# EAGLE design RecoveryBoard (EAGLE 9.4.2)

## Sheet 1 of 2: Power
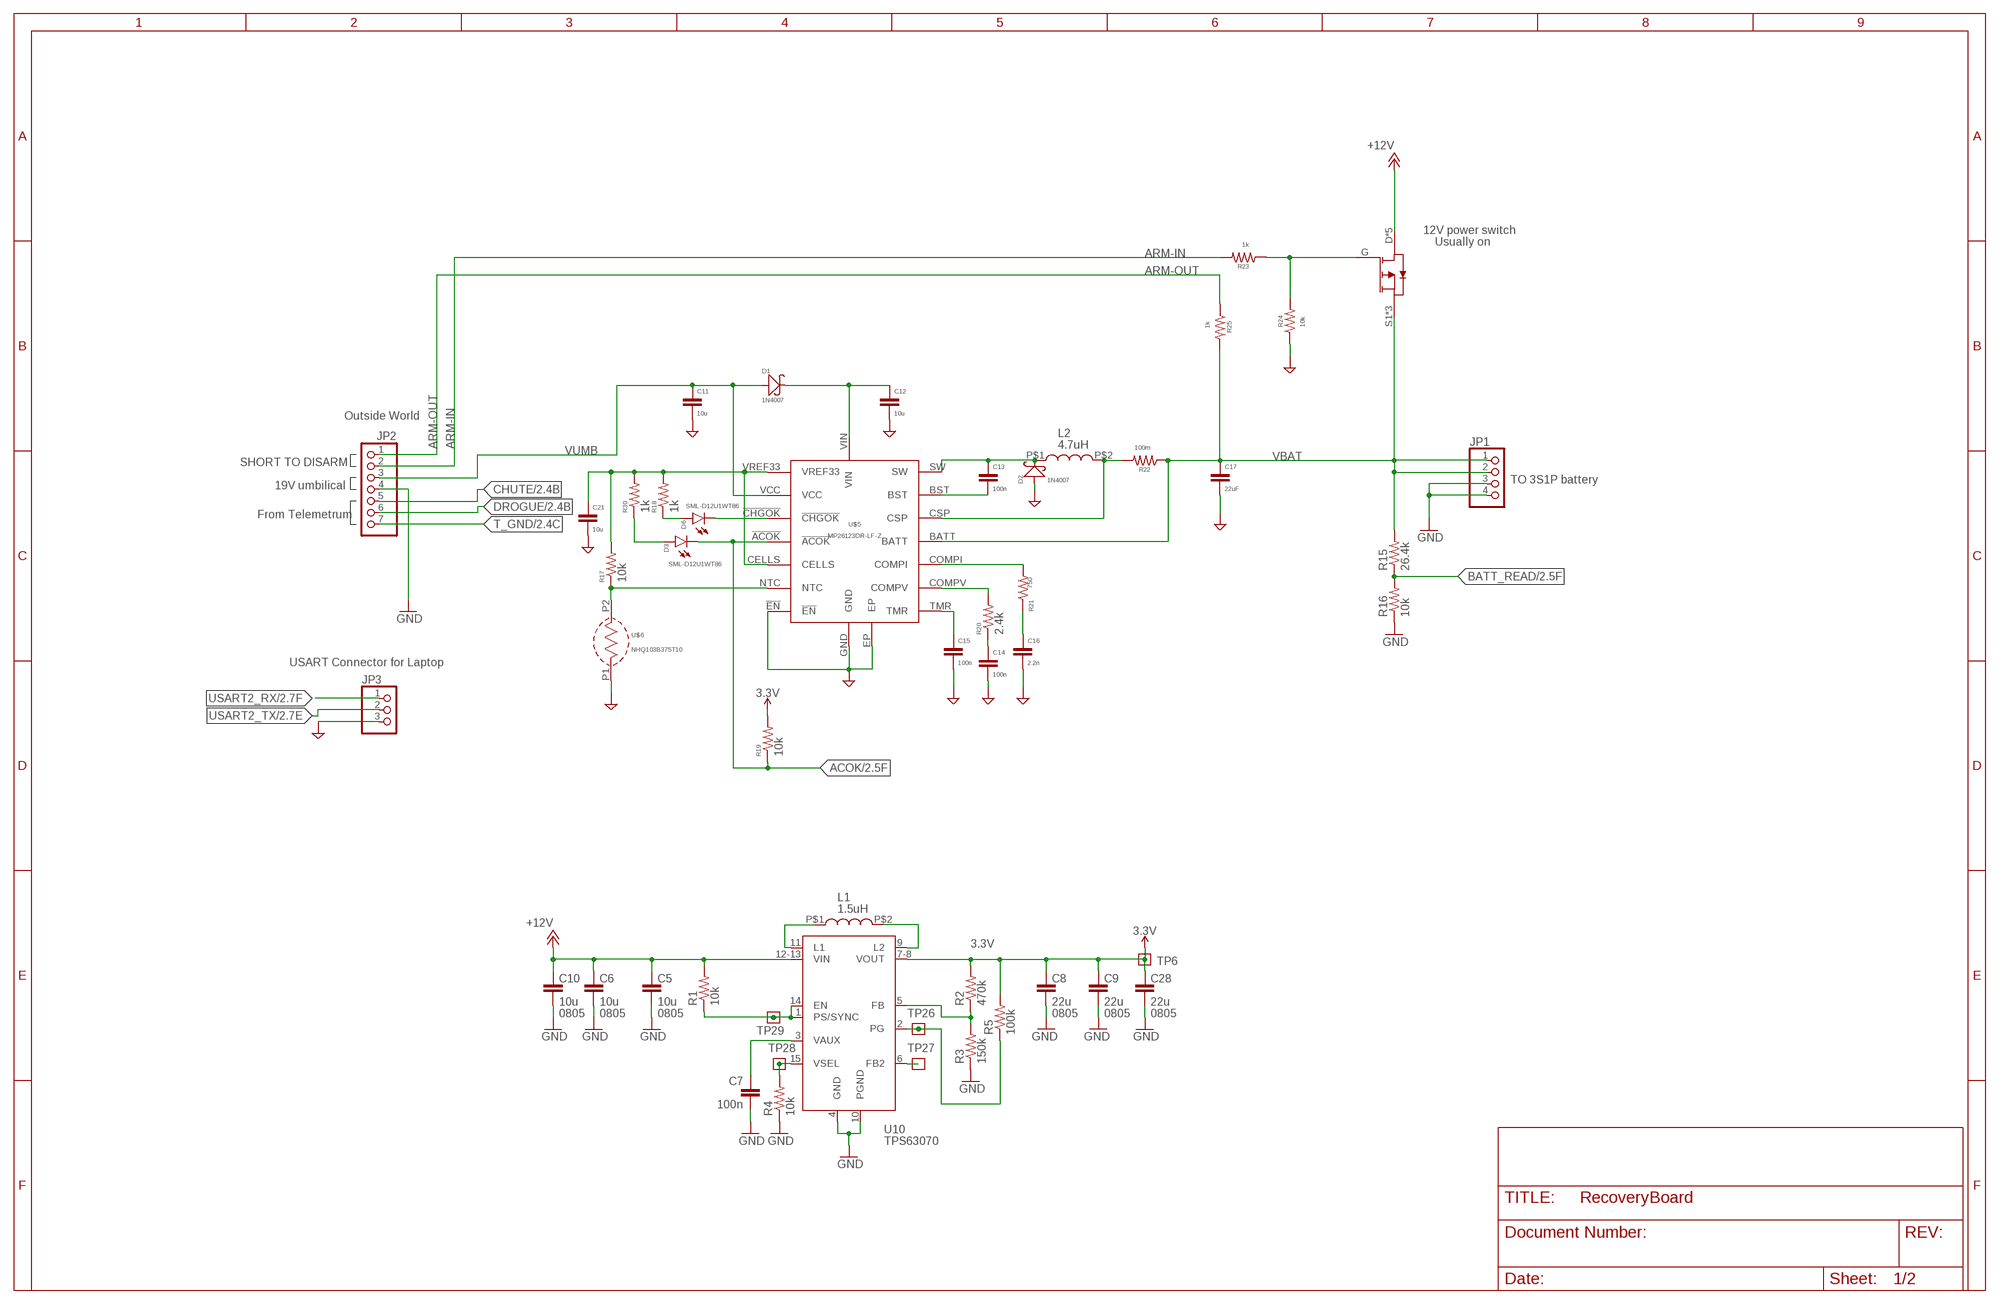
[diagram p0: schematic, sheet 1]

### Parts
C5  10u  C-EU0805-C-NOSILK  [.0805-C-NOSILK]
C6  10u  C-EU0805-C-NOSILK  [.0805-C-NOSILK]
C7  100n  C-EU0603-C-NOSILK  [.0603-C-NOSILK]
C8  22u  C-EU0805-C-NOSILK  [.0805-C-NOSILK]
C9  22u  C-EU0805-C-NOSILK  [.0805-C-NOSILK]
C10  10u  C-EU0805-C-NOSILK  [.0805-C-NOSILK]
C11  10u  C-EU0805-C-NOSILK  [.0805-C-NOSILK]
C12  10u  C-EU0805-C-NOSILK  [.0805-C-NOSILK]
C13  100n  C-EU0603-C-NOSILK  [.0603-C-NOSILK]
C14  100n  C-EU0603-C-NOSILK  [.0603-C-NOSILK]
C15  100n  C-EU0603-C-NOSILK  [.0603-C-NOSILK]
C16  2.2n  C-EU0603-C-NOSILK  [.0603-C-NOSILK]
C17  22uF  C-EU0805-C-NOSILK  [.0805-C-NOSILK]
C21  10u  C-EU0805-C-NOSILK  [.0805-C-NOSILK]
C28  22u  C-EU0805-C-NOSILK  [.0805-C-NOSILK]
D1  1N4007  DIODE-SCHOTTKY-(DO-214AC)  [DO-214AC]
D2  1N4007  DIODE-SCHOTTKY-(DO-214AC)  [DO-214AC]
D3  SML-D12U1WT86  LEDCHIPLED_0603  [CHIPLED_0603]
D6  SML-D12U1WT86  LEDCHIPLED_0603  [CHIPLED_0603]
JP1  PINHD-1X4  [1X04]
JP2  PINHD-1X7  [1X07]
JP3  PINHD-1X3  [1X03]
L1  1.5uH  IHLP2020CZER1R5M11  [IHLP2020CZER1R5M11]
L2  4.7uH  IHLP2020BZER4R7M11  [IHLP2020BZER4R7M11]
R1  10k  R-US_0603-C-NOSILK  [.0603-C-NOSILK]
R2  470k  R-US_0805-A-NOSILK  [.0805-A-NOSILK]
R3  150k  R-US_0603-C-NOSILK  [.0603-C-NOSILK]
R4  10k  R-US_0603-C-NOSILK  [.0603-C-NOSILK]
R5  100k  R-US_0805-A-NOSILK  [.0805-A-NOSILK]
R15  26.4k  R-US_0603-C-NOSILK  [.0603-C-NOSILK]
R16  10k  R-US_0603-C-NOSILK  [.0603-C-NOSILK]
R17  10k  R-US_0603-C-NOSILK  [.0603-C-NOSILK]
R18  1k  R-US_0603-C-NOSILK  [.0603-C-NOSILK]
R19  10k  R-US_0603-C-NOSILK  [.0603-C-NOSILK]
R20  2.4k  R-US_0603-C-NOSILK  [.0603-C-NOSILK]
R21  750  R-US_0603-C-NOSILK  [.0603-C-NOSILK]
R22  100m  R-US_1206-C  [1206-C]
R23  1k  R-US_0603-C-NOSILK  [.0603-C-NOSILK]
R24  10k  R-US_0603-C-NOSILK  [.0603-C-NOSILK]
R25  1k  R-US_0603-C-NOSILK  [.0603-C-NOSILK]
R30  1k  R-US_0603-C-NOSILK  [.0603-C-NOSILK]
TP6  TEST-POINT  [2MM-TEST-POINT]
TP26  TEST-POINT  [2MM-TEST-POINT]
TP27  TEST-POINT  [2MM-TEST-POINT]
TP28  TEST-POINT  [2MM-TEST-POINT]
TP29  TEST-POINT  [2MM-TEST-POINT]
U10  TPS63070  TPS63070X  [TPS63070X]
U$5  MP26123DR-LF-Z  [MP26123DR-LF-Z]
U$6  NHQ103B375T10  [NHQ103B375T10]
U$8  SI7465DP  [SI7465DP]

### Nets
3.3V: C8.1 C9.1 C28.1 R2.2 R5.2 R19.2 TP6.1 U10.7-8(VOUT) ; also sheet 2
!BEN: C12.1 D1.2(-) U$5.VIN
+12V: C5.1 C6.1 C10.1 R1.2 U10.12-13(VIN) U$8.D U$8.D1(D) U$8.D2(D) U$8.D3(D) U$8.D4(D) ; also sheet 2
ACOK: D3.C R19.1 U$5.!ACOK ; also sheet 2
ARM-IN: JP2.2 R23.2
ARM-OUT: JP2.1 R25.1
BATT_READ: R15.1 R16.2 ; also sheet 2
CHUTE: JP2.5 ; also sheet 2
DROGUE: JP2.6 ; also sheet 2
GND: C5.2 C6.2 C7.2 C8.2 C9.2 C10.2 C11.2 C12.2 C14.2 C15.2 C16.2 C17.2 C21.2 C28.2 D2.1(+) JP1.3 JP1.4 JP2.4 JP3.3 R3.1 R4.1 R16.1 R24.1 U10.4(GND) U10.10(PGND) U$5.!EN U$5.EP U$5.GND U$6.P1 ; also sheet 2
N$10: C13.1 D2.2(-) L2.P$1 U$5.SW
N$11: C13.2 U$5.BST
N$12: C21.1 R17.2 R18.2 R30.2 U$5.CELLS U$5.VREF33
N$13: D6.C U$5.!CHGOK
N$14: D3.A R30.1
N$16: R23.1 R24.2 U$8.G
N$17: D6.A R18.1
N$18: R20.2 U$5.COMPV
N$19: C15.1 U$5.TMR
N$20: R17.1 U$5.NTC U$6.P2
N$21: R21.2 U$5.COMPI
N$22: C16.1 R21.1
N$28: L2.P$2 R22.2 U$5.CSP
N$30: C14.1 R20.1
T_GND: JP2.7 ; also sheet 2
TPS-EN: R1.1 TP29.1 U10.1(PS/SYNC) U10.14(EN)
TPS-FB: R2.1 R3.2 U10.5(FB)
TPS-FB2: TP27.1 U10.6(FB2)
TPS-L1: L1.P$1 U10.11(L1)
TPS-L2: L1.P$2 U10.9(L2)
TPS-PG: R5.1 TP26.1 U10.2(PG)
TPS-VAUX: C7.1 U10.3(VAUX)
TPS-VSEL: R4.2 TP28.1 U10.15(VSEL)
USART2_RX: JP3.1 ; also sheet 2
USART2_TX: JP3.2 ; also sheet 2
VBAT: C17.1 JP1.1 JP1.2 R15.2 R22.1 R25.2 U$5.BATT U$8.S1(S) U$8.S2(S) U$8.S3(S)
VUMB: C11.1 D1.1(+) JP2.3 U$5.VCC

### Notes on the sheet
- 12V power switch
- Usually on
- Outside World
- SHORT TO DISARM
- TO 3S1P battery
- 19V umbilical
- From Telemetrum
- USART Connector for Laptop
- 0805 | 0805 | 0805 | 0805 | 0805 | 0805

## Sheet 2 of 2: Microcontroller
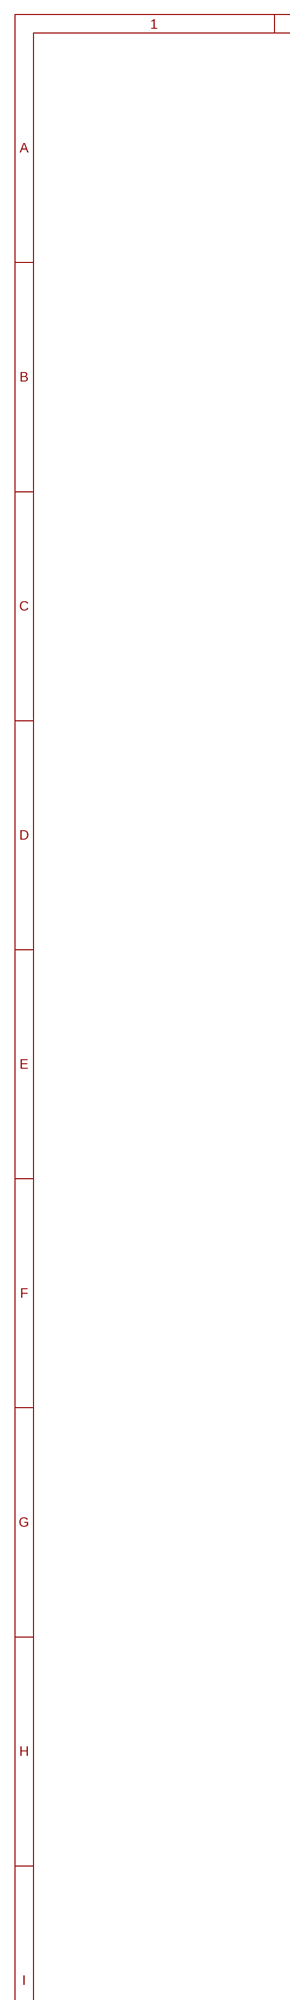
[diagram p1: schematic, sheet 2, part 1 of 2]
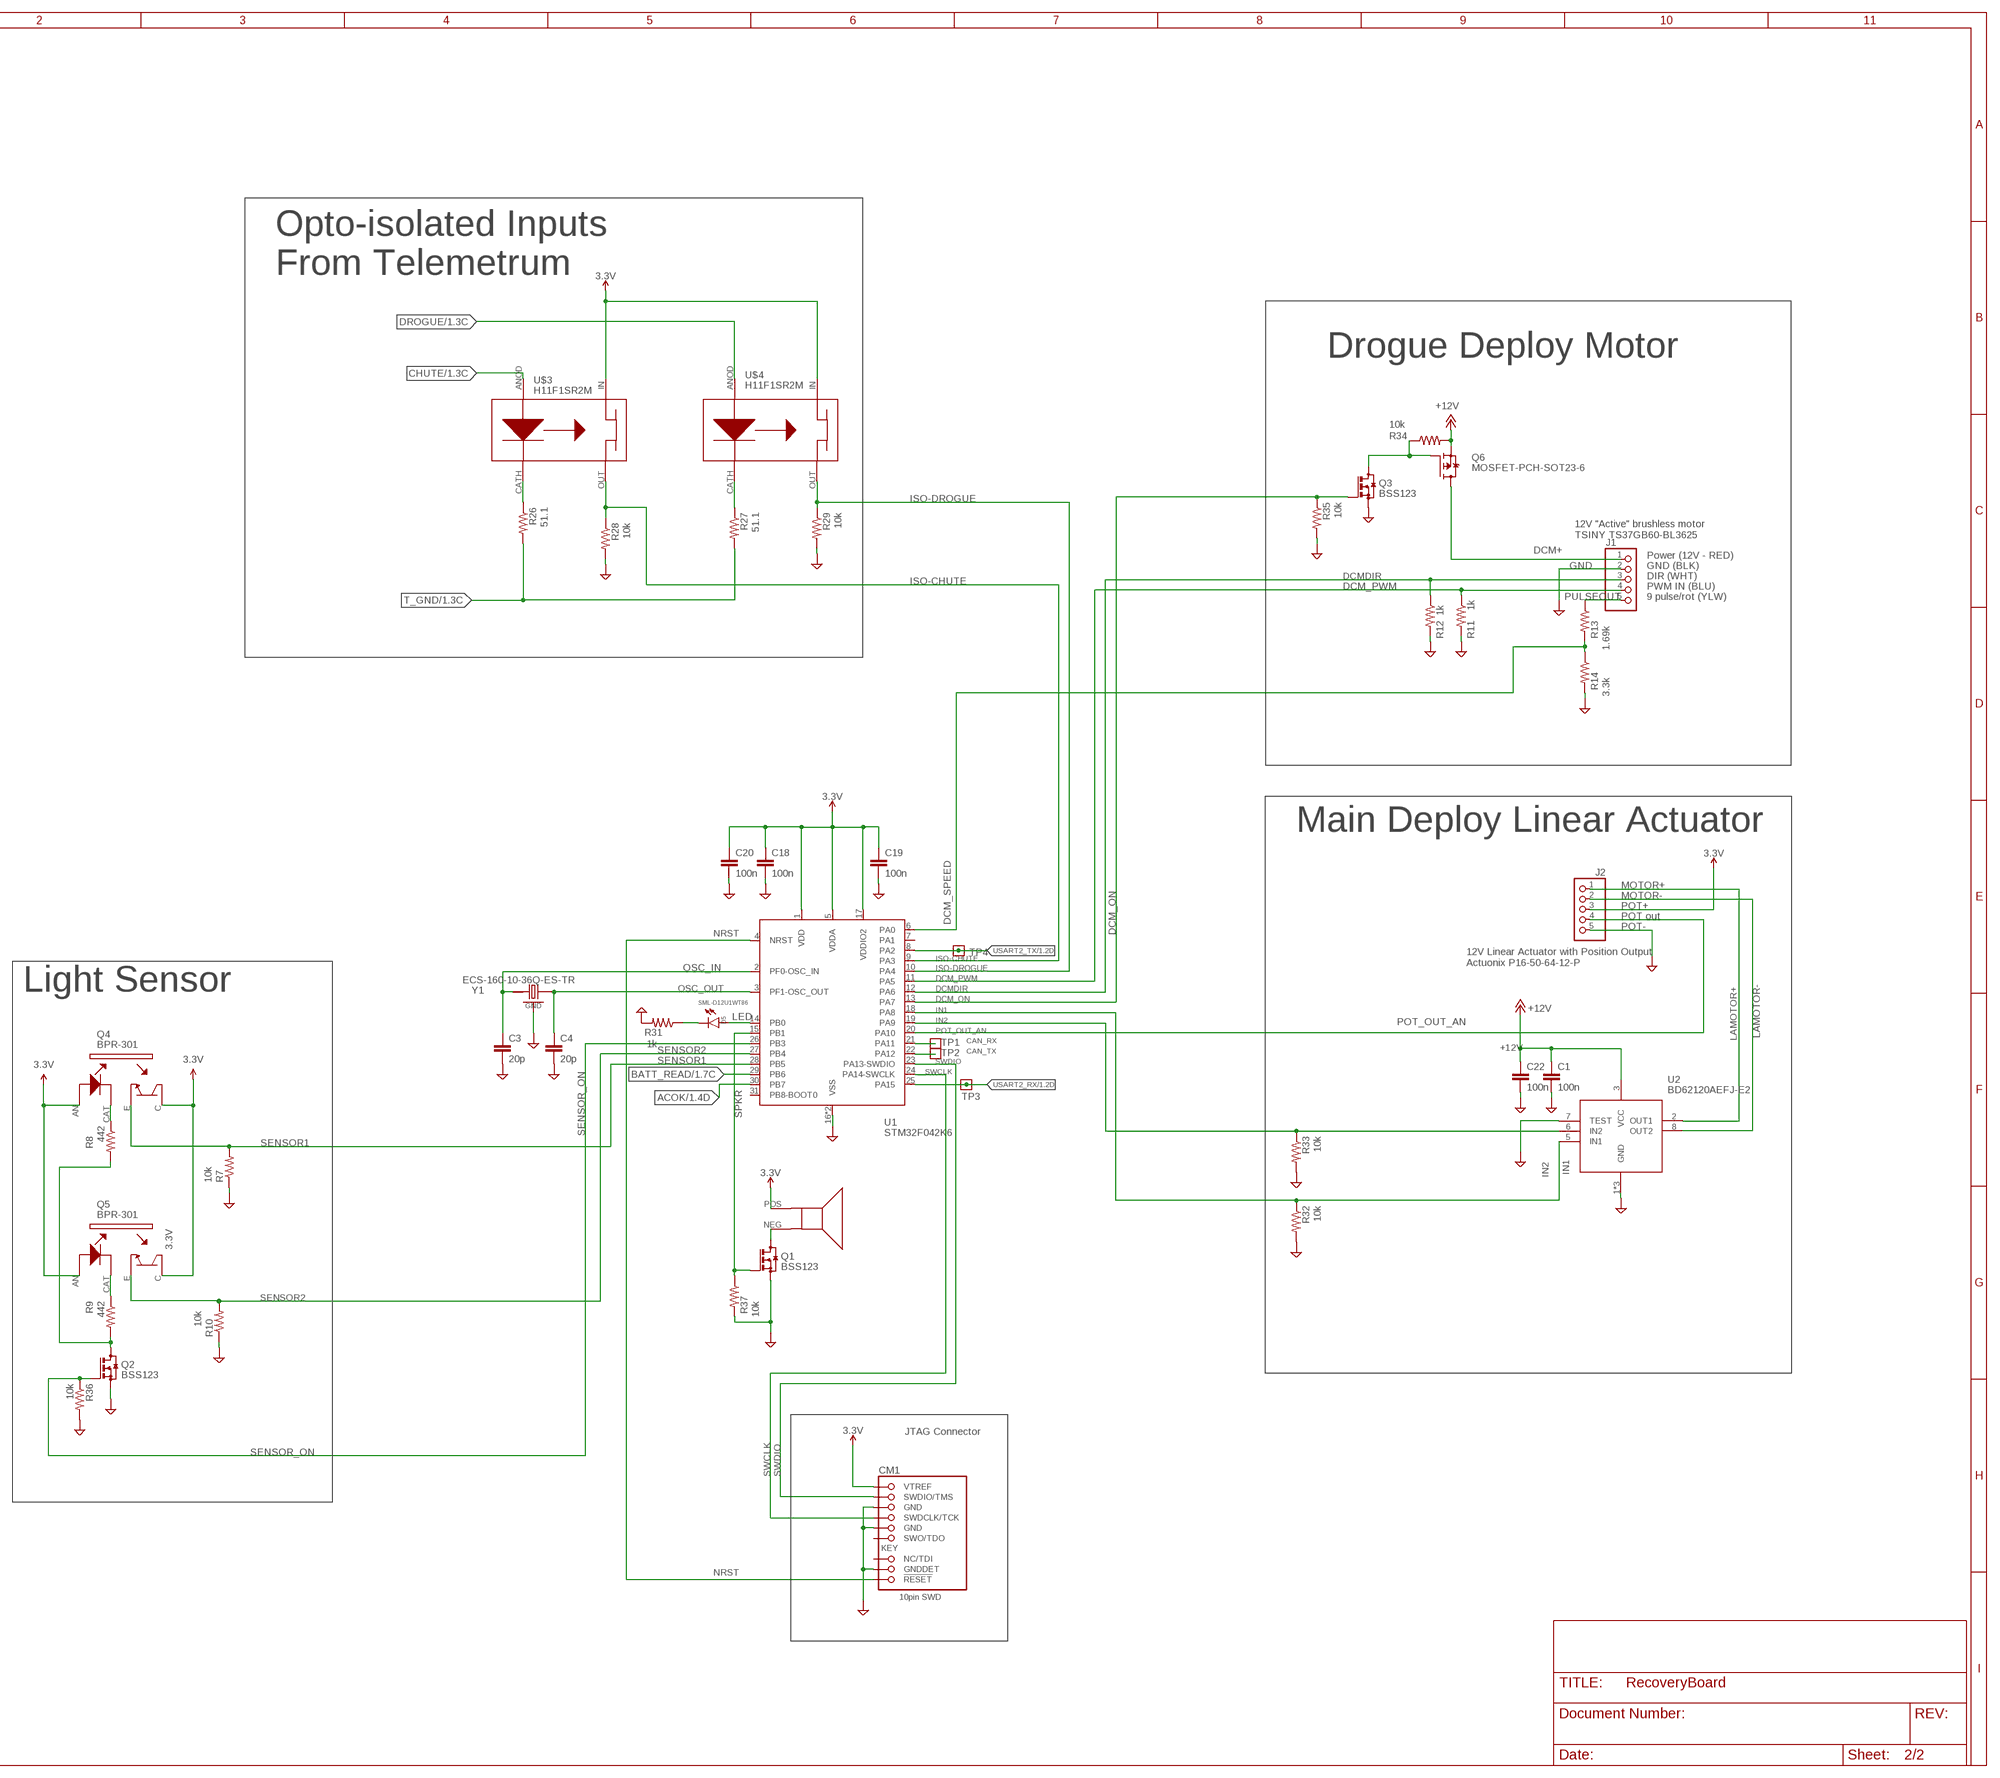
[diagram p2: schematic, sheet 2, part 2 of 2]

### Parts
C1  100n  C-EU0603-C-NOSILK  [.0603-C-NOSILK]
C3  20p  C-EU0603-C-NOSILK  [.0603-C-NOSILK]
C4  20p  C-EU0603-C-NOSILK  [.0603-C-NOSILK]
C18  100n  C-EU0603-C-NOSILK  [.0603-C-NOSILK]
C19  100n  C-EU0603-C-NOSILK  [.0603-C-NOSILK]
C20  100n  C-EU0603-C-NOSILK  [.0603-C-NOSILK]
C22  100n  C-EUC1206  [C1206]
CM1  FTSH-105-XX-X-DV-K  [CON10_2X5_DUK_FTSH]
D5  SML-D12U1WT86  LEDCHIPLED_0603  [CHIPLED_0603]
J1  PINHD-1X5  [1X05]
J2  PINHD-1X5  [1X05]
Q1  BSS123  [SOT23]
Q2  BSS123  [SOT23]
Q3  BSS123  [SOT23]
Q4  BPR-301  [BPR-301]
Q5  BPR-301  [BPR-301]
Q6  MOSFET-PCH-SOT23-6  [SOT23-6]
R7  10k  R-US_0603-C-NOSILK  [.0603-C-NOSILK]
R8  442  R-US_0603-C-NOSILK  [.0603-C-NOSILK]
R9  442  R-US_0603-C-NOSILK  [.0603-C-NOSILK]
R10  10k  R-US_0603-C-NOSILK  [.0603-C-NOSILK]
R11  1k  R-US_0603-C-NOSILK  [.0603-C-NOSILK]
R12  1k  R-US_0603-C-NOSILK  [.0603-C-NOSILK]
R13  1.69k  R-US_0603-C-NOSILK  [.0603-C-NOSILK]
R14  3.3k  R-US_0603-C-NOSILK  [.0603-C-NOSILK]
R26  51.1  R-US_0603-C-NOSILK  [.0603-C-NOSILK]
R27  51.1  R-US_0603-C-NOSILK  [.0603-C-NOSILK]
R28  10k  R-US_0603-C-NOSILK  [.0603-C-NOSILK]
R29  10k  R-US_0603-C-NOSILK  [.0603-C-NOSILK]
R31  1k  R-US_0603-C-NOSILK  [.0603-C-NOSILK]
R32  10k  R-US_0603-C-NOSILK  [.0603-C-NOSILK]
R33  10k  R-US_0603-C-NOSILK  [.0603-C-NOSILK]
R34  10k  R-US_0603-C-NOSILK  [.0603-C-NOSILK]
R35  10k  R-US_0603-C-NOSILK  [.0603-C-NOSILK]
R36  10k  R-US_0603-C-NOSILK  [.0603-C-NOSILK]
R37  10k  R-US_0603-C-NOSILK  [.0603-C-NOSILK]
TP1  TEST-POINT  [2MM-TEST-POINT]
TP2  TEST-POINT  [2MM-TEST-POINT]
TP3  TEST-POINT  [2MM-TEST-POINT]
TP4  TEST-POINT  [2MM-TEST-POINT]
U1  STM32F042K6  [QFP32-7X7]
U2  BD62120AEFJ-E2  [SOIC127P600X100-9N]
U$3  H11F1SR2M  [H11F1SR2M]
U$4  H11F1SR2M  [H11F1SR2M]
U$7  SMT-0440-S-R  [SMT-0440-S-R]
Y1  ECS-160-10-36Q-ES-TR  [XTAL_ECS-160-10-36Q-ES-TR]

### Nets
3.3V: C18.1 C19.1 C20.1 CM1.1(VTREF) J2.3 Q4.AN(ANOD) Q4.C(COLL) Q5.AN(ANOD) Q5.C(COLL) U1.1(VDD) U1.5(VDDA) U1.17(VDDIO2) U$3.IN U$4.IN U$7.POS ; also sheet 1
+12V: C1.1 C22.1 Q6.4(S) R34.2 U2.3(VCC) ; also sheet 1
ACOK: U1.30(PB7) ; also sheet 1
BATT_READ: U1.29(PB6) ; also sheet 1
CAN_RX: TP1.1 U1.21(PA11)
CAN_TX: TP2.1 U1.22(PA12)
CHUTE: U$3.ANOD ; also sheet 1
DCM+: J1.1 Q6.1(D) Q6.2(D) Q6.5(D) Q6.6(D)
DCM_ON: Q3.1(G) R35.1 U1.13(PA7)
DCM_PWM: J1.4 R11.1 U1.11(PA5)
DCM_SPEED: R13.2 R14.1 U1.6(PA0)
DCMDIR: J1.3 R12.1 U1.12(PA6)
DROGUE: U$4.ANOD ; also sheet 1
GND: C1.2 C3.2 C4.2 C18.2 C19.2 C20.2 C22.2 CM1.3(GND) CM1.5(GND) CM1.9(GNDDET) J1.2 J2.5 Q1.2(S) Q2.2(S) Q3.2(S) R7.1 R10.1 R11.2 R12.2 R14.2 R28.2 R29.2 R31.2 R32.2 R33.2 R35.2 R36.2 R37.2 U1.16(VSS) U1.32(VSS) U2.1(GND) U2.4(GND) U2.9(GND) Y1.GND Y1.GND2(GND) ; also sheet 1
IN1: R32.1 U1.18(PA8) U2.5(IN1)
IN2: R33.1 U1.19(PA9) U2.6(IN2)
ISO-CHUTE: R28.1 U1.9(PA3) U$3.OUT
ISO-DROGUE: R29.1 U1.10(PA4) U$4.OUT
LAMOTOR+: J2.1 U2.2(OUT1)
LAMOTOR-: J2.2 U2.8(OUT2)
LED: D5.A U1.14(PB0)
N$1: Q1.3(D) U$7.NEG
N$2: Q4.CAT(CATH) R8.1
N$3: U2.7(TEST) ; supply symbol labelled GND
N$4: D5.C R31.1
N$5: Q5.CAT(CATH) R9.1
N$6: Q3.3(D) Q6.3(G) R34.1
N$7: R26.1 U$3.CATH(CAT)
N$26: R27.1 U$4.CATH(CAT)
N$27: Q2.3(D) R8.2 R9.2
NRST: CM1.10(!RESET) U1.4(NRST)
OSC_IN: C3.1 U1.2(PF0-OSC_IN) Y1.IN/OUT
OSC_OUT: C4.1 U1.3(PF1-OSC_OUT) Y1.OUT/IN
POT_OUT_AN: J2.4 U1.20(PA10)
PULSEOUT: J1.5 R13.1
SENSOR1: Q4.E(EMIT) R7.2 U1.28(PB5)
SENSOR2: Q5.E(EMIT) R10.2 U1.27(PB4)
SENSOR_ON: Q2.1(G) R36.1 U1.26(PB3)
SPKR: Q1.1(G) R37.1 U1.15(PB1)
SWCLK: CM1.4(SWDCLK/TCK) U1.24(PA14-SWCLK)
SWDIO: CM1.2(SWDIO/TMS) U1.23(PA13-SWDIO)
T_GND: R26.2 R27.2 ; also sheet 1
USART2_RX: TP3.1 U1.25(PA15) ; also sheet 1
USART2_TX: TP4.1 U1.8(PA2) ; also sheet 1
Unconnected: CM1.6(SWO/TDO) CM1.8(NC/TDI) U1.7(PA1) U1.31(PB8-BOOT0)

### Notes on the sheet
- Opto-isolated Inputs
  From Telemetrum
- Drogue Deploy Motor
- 12V "Active" brushless motor
  TSINY TS37GB60-BL3625
- Power (12V - RED)
- GND (BLK)
- DIR (WHT)
- PWM IN (BLU)
- 9 pulse/rot (YLW)
- Main Deploy Linear Actuator
- MOTOR+
- MOTOR-
- POT+
- POT out
- POT-
- 12V Linear Actuator with Position Output
  Actuonix P16-50-64-12-P
- Light Sensor
- JTAG Connector

## Library data of the parts
C1 C3 C4 C6 C9-C22 C28 = oresat-rcl:C-EU: CAPACITOR, European symbol
C5 C7 C8 = oresat-rcl:C-EU: CAPACITOR, European symbol; DIS: Digi-Key; DPN: 1276-1001-1-ND; MFR: Samsung; MPN: CL05B104KO5NNNC
CM1 = J-Samtec-FTSH-105-XXX-DV-K-ARM-SWD:FTSH-105-XX-X-DV-K
D1 D2 = D-Generic-Schottky-DO-214AC-SMA:DIODE-SCHOTTKY-(DO-214AC): 304010013; MPN: 1N4007
D3 D5 D6 = led:LED: LED OSRAM: - CHIPLED LG R971, LG N971, LY N971, LG Q971, LY Q971, LO R971, LY R971 LH N974, LH R974 LS Q976, LO Q976, LY Q976 LO Q996 - Hyper CHIPLED LW Q18S LB Q993, LB Q99A, LB R99A - SideLED LS A670, LO A670, LY A670, LG A670, LP A670 LB A673, LV A673, LT A673, LW A673 LH A674 LY A675 LS A676, LA A676, LO A676, LY A676, LW A676 LS A679, LY A679, LG A679 - Hyper Micro SIDELED® LS Y876, LA Y876, LO Y876, LY Y876 LT Y87S - SmartLED LW L88C, LW L88S LB L89C, LB L89S, LG L890 LS L89K, LO L89K, LY L89K LS L896, LA L896, LO L896, LY L896 - TOPLED LS T670, LO T670, LY T670, LG T670, LP T670 LSG T670, LSP T670, LSY T670, LOP T670, LYG T670 LG T671, LOG T671, LSG T671 LB T673, LV T673, LT T673, LW T673 LH T674 LS T676, LA T676, LO T676, LY T676, LB T676, LH T676, LSB T676, LW T676 LB T67C, LV T67C, LT T67C, LS T67K, LO T67K, LY T67K, LW E67C LS E67B, LA E67B, LO E67B, LY E67B, LB E67C, LV E67C, LT E67C LW T67C LS T679, LY T679, LG T679 LS T770, LO T770, LY T770, LG T770, LP T770 LB T773, LV T773, LT T773, LW T773 LH T774 LS E675, LA E675, LY E675, LS T675 LS T776, LA T776, LO T776, LY T776, LB T776 LHGB T686 LT T68C, LB T68C - Hyper Mini TOPLED® LB M676 - Mini TOPLED Santana® LG M470 LS M47K, LO M47K, LY M47K Source: http://www.osram.convergy.de LUXEON: - LUMILED® LXK2-PW12-R00, LXK2-PW12-S00, LXK2-PW14-U00, LXK2-PW14-V00 LXK2-PM12-R00, LXK2-PM12-S00, LXK2-PM14-U00 LXK2-PE12-Q00, LXK2-PE12-R00, LXK2-PE12-S00, LXK2-PE14-T00, LXK2-PE14-U00 LXK2-PB12-K00, LXK2-PB12-L00, LXK2-PB12-M00, LXK2-PB14-N00, LXK2-PB14-P00, LXK2-PB14-Q00 LXK2-PR12-L00, LXK2-PR12-M00, LXK2-PR14-Q00, LXK2-PR14-R00 LXK2-PD12-Q00, LXK2-PD12-R00, LXK2-PD12-S00 LXK2-PH12-R00, LXK2-PH12-S00 LXK2-PL12-P00, LXK2-PL12-Q00, LXK2-PL12-R00 Source: www.luxeon.com KINGBRIGHT: KA-3528ASYC Source: www.kingbright.com; DIS: Digikey; DPN: SML-D12U1WT86CT-ND; MPN: SML-D12U1WT86
J1 J2 = pinhead:PINHD-1X5: PIN HEADER
JP1 = pinhead:PINHD-1X4: PIN HEADER
JP2 = pinhead:PINHD-1X7: PIN HEADER
JP3 = pinhead:PINHD-1X3: PIN HEADER
L1 = L--IHLP2020CZER1R5M11--1.5uHInductor:IHLP2020CZER1R5M11; DIS: Digi-Key; DPN: 541-1222-1-ND; MFR: Vishay Dale; MPN: IHLP2020BZER4R7M11
L2 = L--IHLP2020BZER4R7M11--4.7uInductor:IHLP2020BZER4R7M11; DIS: Digi-Key; DPN: 541-1222-1-ND; MFR: Vishay Dale; MPN: IHLP2020BZER4R7M11
Q1-Q3 = transistor-small-signal:BSS123: N-CHANNEL MOS FET
Q4 Q5 = Q--BPR-301--Phototransistor:BPR-301; DATASHEET: http://americanbrightled.com/pdffiles/infrared/BPR-301.pdf; DIS: DigiKey; DPN: BPR-301-ND; MPN: BPR-301
Q6 = Q-MOSFET-PCH-SOT23-6:MOSFET-PCH-SOT23-6: P channel MOSFET in an SOT23-6
R1-R5 R15 R16 = oresat-rcl:R-US_: RESISTOR, American symbol; DIS: Digi-Key; DPN: 1276-4275-1-ND; MFR: Samsung; MPN: RC1005F6653CS
R7-R14 R17-R37 = oresat-rcl:R-US_: RESISTOR, American symbol
TP1-TP4 TP6 TP26-TP29 = Tova:TEST-POINT
U1 = U-ST-STM32F042K-uC:STM32F042K6
U2 = SamacSys_Parts:BD62120AEFJ-E2: ROHM BD62120AEFJ-E2 Motor Driver IC 8-Pin, HTSOP-J Source: Datasheet <https://componentsearchengine.com/Datasheets/1/BD62120AEFJ-E2.pdf>; DESCRIPTION: ROHM BD62120AEFJ-E2 Motor Driver IC 8-Pin, HTSOP-J; HEIGHT: 1mm; MANUFACTURER_NAME: ROHM Semiconductor; MANUFACTURER_PART_NUMBER: BD62120AEFJ-E2; MOUSER_PART_NUMBER: 755-BD62120AEFJ-E2; MOUSER_PRICE-STOCK: https://www.mouser.com/Search/Refine.aspx?Keyword=755-BD62120AEFJ-E2
U10 = ic-pwr-tps63070x:TPS63070X: TPS63070 2-V to 16-V Buck-Boost Converter With 3.6-A Switch Current
U$3 U$4 = Q--H11F1SR2M--OptoIsolator:H11F1SR2M
U$5 = U--MP26123DR-LF-Z--LiPo Charger:MP26123DR-LF-Z
U$6 = R--NHQ103B375T10--Thermistor:NHQ103B375T10
U$7 = SPK--SMT-0440-S-R--Speaker:SMT-0440-S-R
U$8 = Q--Si7465DP--Vishay Power MOSFET with multple S+D leads:SI7465DP
Y1 = ECS-160-10-36Q-ES-TR:ECS-160-10-36Q-ES-TR: The ECX-2236Q is a miniature SMD Crystal with a 2.5 x 2.0 mm; DESCRIPTION: Crystal 16MHz ±30ppm _Tol_ ±50ppm _Stability_ 10pF FUND 80Ohm Automotive 4-Pin SMD T/R; DIGI-KEY_PART_NUMBER: XC2181CT-ND; DIGI-KEY_PURCHASE_URL: https://www.digikey.com/product-detail/en/ecs-inc/ECS-160-10-36Q-ES-TR/XC2181CT-ND/6134150?utm_source=snapeda&utm_medium=aggregator&utm_campaign=symbol; MF: ECS Inc.; MP: ECS-160-10-36Q-ES-TR; PACKAGE: SMD-4 ECS International

## Board
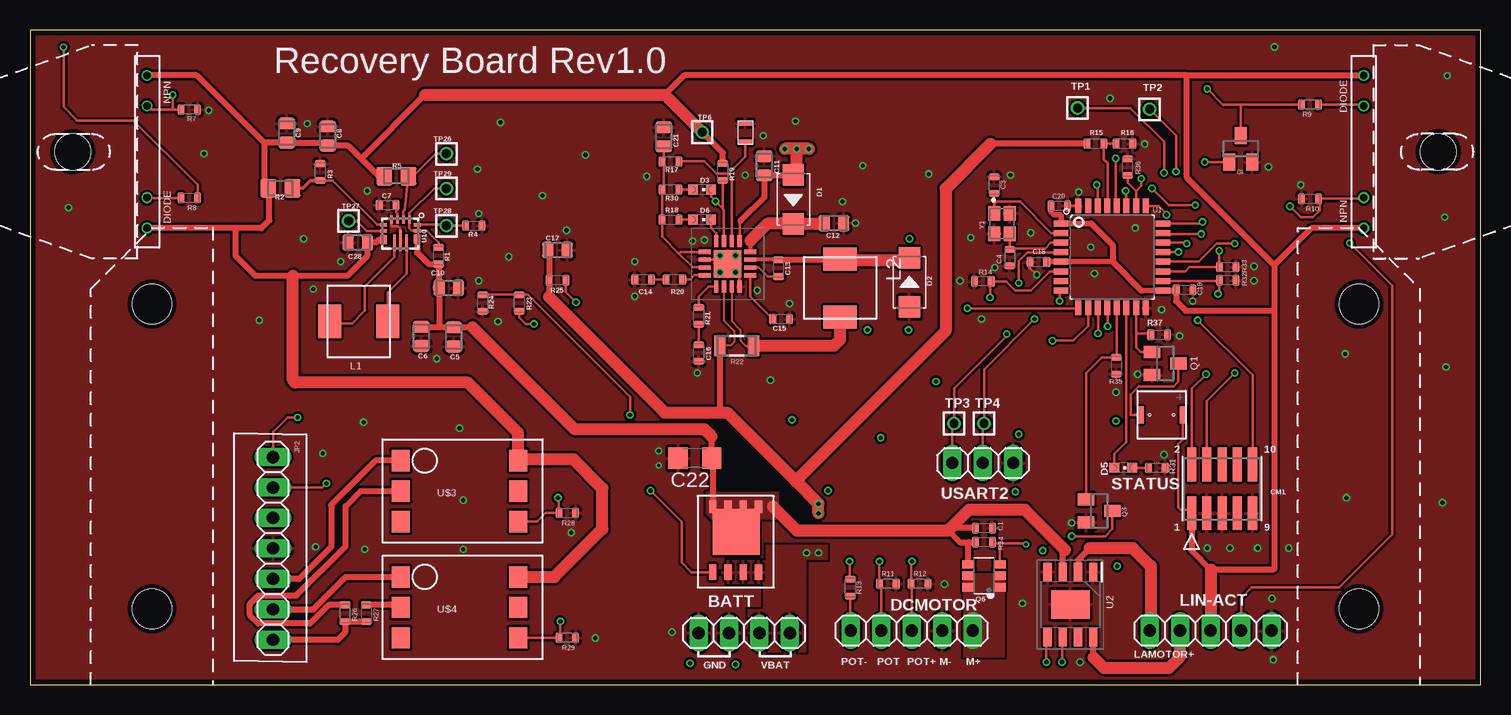
[diagram p3: board, top side]
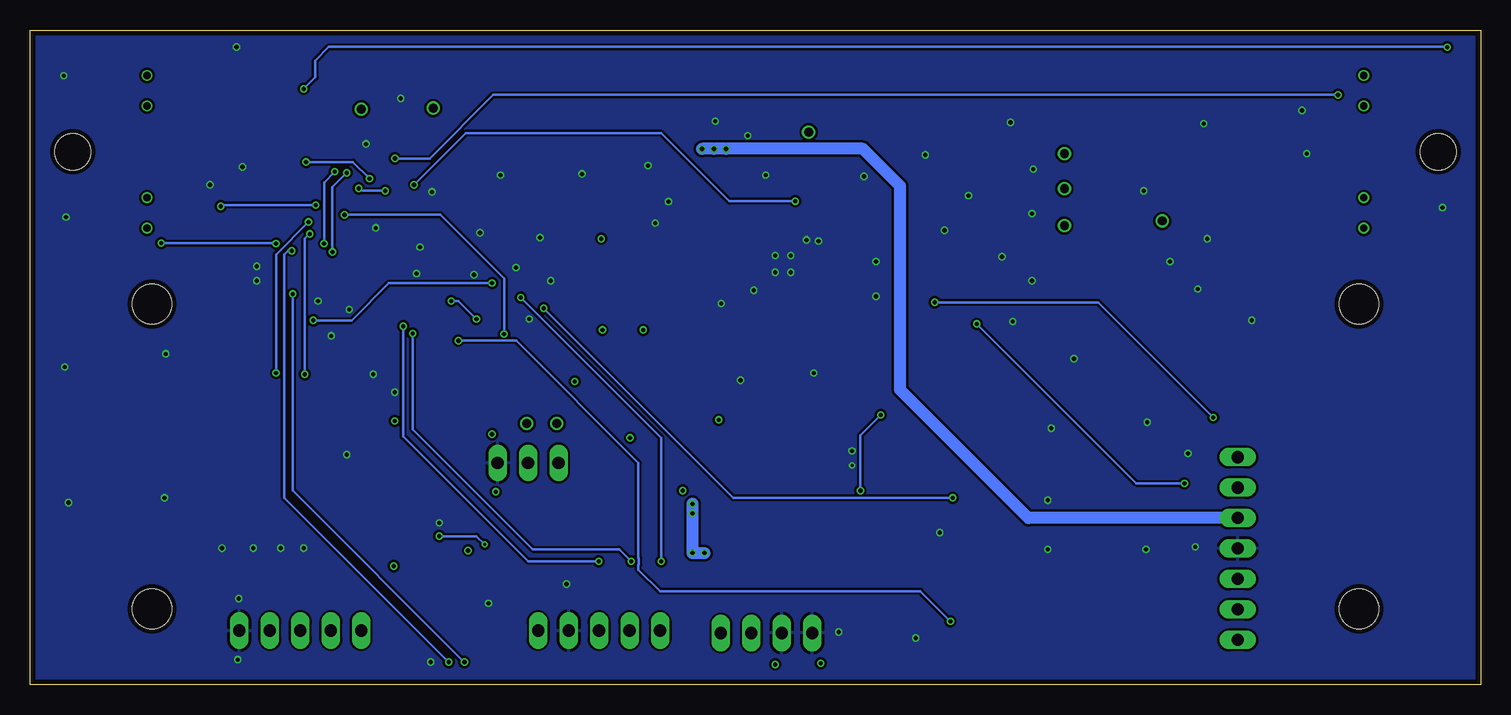
[diagram p4: board, bottom side, seen from below]

Size 120.9 x 54.61 mm. Coordinates in mm from the lower left corner, seen from the top.
Outline: 0,0 120.9,0 120.9,54.61 0,54.61 0,0
Copper layers (1*16): Top 0.035559375mm / dielectric 1.6mm / Bottom 0.035559375mm
Design rules "oshpark-2layer-tented": minimum track width 6mil, minimum drill 10mil, track to track 6mil, track to pad 6mil, pad to pad 6mil, via to via 6mil, smd to smd 6mil, copper to edge 15mil, drill to drill 6mil, minimum pad ring 5mil, minimum via ring 5mil, stop-mask expansion 2.5mil, vias tented up to drill 20mil, thermal gap 10mil
Holes 3 mm at 3.56,44.45 117.35,44.45
Holes 3.3 mm at 10.16,6.35 10.16,31.75 110.74,31.75 110.74,6.35

### Footprints (pad centres in the part's own frame; a part is rotated, then mirrored left to right if it is on the bottom)
.0603-C-NOSILK = smd 0.6 x 0.9: 1 -0.7,0; 2 0.7,0
.0805-C-NOSILK = smd 0.95 x 1.35: 1 -0.8,0; 2 0.8,0
C1206 = smd 1.6 x 1.8: 1 -1.4,0; 2 1.4,0
CON10_2X5_DUK_FTSH = smd 0.762 x 2.794: 1 -2.54,-2.032; 2 -2.54,2.032; 3 -1.27,-2.032; 4 -1.27,2.032; 5 0,-2.032; 6 0,2.032; 7 1.27,-2.032; 8 1.27,2.032; 9 2.54,-2.032; 10 2.54,2.032
DO-214AC = smd 1.8 x 1.77: 1 -2.042,0; 2 2.042,0
CHIPLED_0603 = smd 0.8 x 0.8: A 0,-0.75; C 0,0.75
1X05 = drill 1.016 long: 1 -5.08,0; 2 -2.54,0; 3 0,0; 4 2.54,0; 5 5.08,0
1X04 = drill 1.016 long: 1 -3.81,0; 2 -1.27,0; 3 1.27,0; 4 3.81,0
1X07 = drill 1.016 long: 1 -7.62,0; 2 -5.08,0; 3 -2.54,0; 4 0,0; 5 2.54,0; 6 5.08,0; 7 7.62,0
1X03 = drill 1.016 long: 1 -2.54,0; 2 0,0; 3 2.54,0
IHLP2020CZER1R5M11 = smd 1.905 x 2.79: P$1 -2.42,0; P$2 2.42,0
IHLP2020BZER4R7M11 = smd 1.905 x 2.79: P$1 -2.42,0; P$2 2.42,0
SOT23 = smd 1 x 1.4: 1 -0.95,-1.1; 2 0.95,-1.1; 3 0,1.1
BPR-301 = drill 0.6: AN -6.37,0; C 6.37,0; CAT -3.83,0; E 3.83,0
SOT23-6 = smd 0.7 x 1: 1 -0.95,-1.3; 2 0,-1.3; 3 0.95,-1.3; 4 0.95,1.3; 5 0,1.3; 6 -0.95,1.3
.0805-A-NOSILK = smd 1.35 x 1.55: 1 -1,0; 2 1,0
1206-C = smd 0.95 x 1.7: 1 -1.4,0; 2 1.4,0
2MM-TEST-POINT = drill 0.737: 1 0,0
QFP32-7X7 = smd 1.2 x 0.5: 1 -4.25,2.8; 2 -4.25,2; 3 -4.25,1.2; 4 -4.25,0.4; 5 -4.25,-0.4; 6 -4.25,-1.2; 7 -4.25,-2; 8 -4.25,-2.8; 17 4.25,-2.8; 18 4.25,-2; 19 4.25,-1.2; 20 4.25,-0.4; 21 4.25,0.4; 22 4.25,1.2; 23 4.25,2; 24 4.25,2.8 | smd 0.5 x 1.2: 9 -2.8,-4.25; 10 -2,-4.25; 11 -1.2,-4.25; 12 -0.4,-4.25; 13 0.4,-4.25; 14 1.2,-4.25; 15 2,-4.25; 16 2.8,-4.25; 25 2.8,4.25; 26 2,4.25; 27 1.2,4.25; 28 0.4,4.25; 29 -0.4,4.25; 30 -1.2,4.25; 31 -2,4.25; 32 -2.8,4.25
SOIC127P600X100-9N = smd 1.525 x 0.7: 1 -2.712,1.905; 2 -2.712,0.635; 3 -2.712,-0.635; 4 -2.712,-1.905; 5 2.712,-1.905; 6 2.712,-0.635; 7 2.712,0.635; 8 2.712,1.905 | smd 2.4 x 3.2: 9 0,0
TPS63070X = smd 0.6 x 0.25: 1 -1.15,0.75; 2 -1.15,0.25; 3 -1.15,-0.25; 4 -1.15,-0.75 | smd 0.25 x 0.6: 5 -0.725,-1.4; 6 -0.225,-1.4; 14 -0.225,1.4; 15 -0.725,1.4 | smd 0.75 x 0.6: 7-8 0.525,-1.4; 12-13 0.475,1.4 | smd 1.35 x 0.25: 9 0.775,-0.5; 11 0.775,0.5 | smd 1.7 x 0.25: 10 0.6,0
H11F1SR2M = smd 1.52 x 1.78: ANOD 0,0; CATH 0,-2.54; IN 9.78,0; OUT 9.78,-5.08; P0 9.78,-2.54; P2 0,-5.08
MP26123DR-LF-Z = smd 1 x 0.35: !ACOK -1.9,-0.3; !CHGOK -1.9,-0.95; BATT 1.9,-0.3; COMPI 1.9,-0.95; CSP 1.9,0.35; GND 1.9,1; NTC -1.9,0.35; VCC -1.9,1 | smd 0.35 x 1: !EN -0.35,-1.9; BST 0.3,1.9; CELLS 0.3,-1.9; COMPV 0.95,-1.9; SW -0.35,1.9; TMR 0.95,1.9; VIN -1,1.9; VREF33 -1,-1.9 | smd 2.3 x 2.3: EP 0,0
NHQ103B375T10 = smd 0.4 x 1.25: P1 -0.8,0; P2 0.8,0
SMT-0440-S-R = smd 0.5 x 1.4: NEG -1.75,0; POS 1.75,0
SI7465DP = smd 3.81 x 3.91: D 3.36,-1.955 | smd 1.02 x 0.61: D1 5.465,0; D2 5.465,-1.27; D3 5.465,-2.54; D4 5.465,-3.81 | smd 1.27 x 0.61: G 0,0; S1 0,-1.27; S2 0,-2.54; S3 0,-3.81
XTAL_ECS-160-10-36Q-ES-TR = smd 1.2 x 1: GND -0.85,0.65; GND2 0.85,-0.65; IN/OUT -0.85,-0.65; OUT/IN 0.85,0.65

### Placement (x,y rotation side)
C1  79.5,13.07 0 top
C3  80.35,41.67 90 top
C4  81.65,35.63 270 top
C5  35.31,29.01 270 top
C6  32.61,29.06 270 top
C7  29.8,40 180 top
C8  24.81,45.76 90 top
C9  21.39,46.01 90 top
C10  34.9,33.11 0 top
C11  61.19,43.28 90 top
C12  67,38.5 0 top
C13  62.37,34.75 270 top
C14  51.1,33.8 180 top
C15  62.6,30.5 0 top
C16  55.73,27.67 270 top
C17  43.96,36.27 0 top
C18  84.03,35.25 180 top
C19  96.22,32.95 0 top
C20  85.77,39.95 0 top
C21  52.8,45.7 90 top
C22  55.4,18.9 180 top
C28  27.31,36.89 180 top
CM1  99.34,16.35 0 top
D1  63.61,40.49 270 top
D2  73.29,33.56 90 top
D3  56,41.3 270 top
D5  91.1,18.1 270 top
D6  56,38.8 270 top
J1  73.48,4.53 180 top
J2  98.38,4.53 0 top
JP1  59.52,4.33 180 top
JP2  20.25,11.37 270 top
JP3  79.4,18.5 0 top
L1  27.4,30.3 180 top
L2  67.5,33.1 270 top
Q1  94.6,26.8 270 top
Q2  100.9,44.7 0 top
Q3  89.1,14.5 270 top
Q4  9.75,44.45 90 top
Q5  111.15,44.45 270 top
Q6  79.5,9.1 90 top
R1  34.05,35.79 270 top
R2  20.87,41.41 180 top
R3  24.19,42.76 270 top
R4  36.98,38.29 180 top
R5  30.54,42.41 180 top
R7  13.27,47.97 180 top
R8  13.27,40.61 0 top
R9  106.67,48.39 180 top
R10  106.67,40.53 0 top
R11  71.49,8.43 0 top
R12  74.13,8.43 0 top
R13  68.35,8.11 90 top
R14  79.4,33.65 180 top
R15  88.79,45.13 180 top
R16  91.2,45.13 180 top
R17  53.37,43.63 180 top
R18  53.37,38.79 180 top
R19  57.73,42.77 90 top
R20  53.7,33.8 0 top
R21  55.73,30.78 90 top
R22  58.89,28.27 0 top
R23  40.77,31.84 270 top
R24  37.73,31.84 90 top
R25  43.96,33.73 180 top
R26  26.25,5.97 270 top
R27  28.03,5.97 270 top
R28  44.77,14.33 0 top
R29  44.77,3.93 0 top
R30  53.37,41.3 180 top
R31  93.9,18.1 0 top
R32  99.81,33.73 0 top
R33  99.81,34.83 0 top
R34  79.5,11.9 180 top
R35  90.53,26.61 270 top
R36  91.47,43.17 90 top
R37  94.1,29.2 0 top
TP1  87.3,48.1 0 top
TP2  93.3,48 0 top
TP3  77,21.8 0 top
TP4  79.5,21.8 0 top
TP6  56.02,46.09 0 top
TP26  34.7,44.29 0 top
TP27  26.55,38.69 0 top
TP28  34.7,38.29 0 top
TP29  34.7,41.39 0 top
U1  90.17,35.68 0 top
U2  86.7,6.7 270 top
U10  30.87,37.65 270 top
U$3  30.9,18.7 0 top
U$4  30.9,9 0 top
U$5  58.13,35.11 270 top
U$6  59.61,46.05 270 top
U$7  94.3,22.51 0 top
U$8  56.9,9.4 90 top
Y1  80.98,38.47 270 top

### Tracks (layer width: path | path; a pad name or v marks a point on that pad's centre or on a via)
3.3V
  Top 0.2: U$7.POS 96.05,20.45 95.7,20.1 95.7,14.8 95.9,14.6 96.52,14.6 CM1.1
  Top 0.4: 85.3,39.2 85.07,39.43 C20.1
  Top 0.45: 84.76,35.28 U1.5 90.22,35.28 | 88.42,38.48 U1.1 85.92,39.08 85.8,39.2 85.3,39.2 | 92.68,32.88 U1.17 95.45,32.88
  Top 0.5: CM1.1 96.8,11.2 98.4,9.6 103.6,9.6 103.7,9.7 103.7,31.2 | R5.2 29.06,42.41 27.59,43.88 | 27.59,43.88 26.51,44.96 C8.1 24.56,45.21 C9.1 19.5,45.2 | 27.59,43.88 32.9,49.2 | 84.76,35.28 C18.1 | 96.4,50.82 54.53,50.82 52.91,49.2 | 103.7,35 96.4,42.3 96.4,50.82 | 103.7,35 103.7,31.2 | 88.42,38.48 90.22,36.68 90.22,35.28 92.65,32.85 92.68,32.88 | 17.14,38.08 17.14,35.76 18.8,34.1 21.9,34.1 26.42,34.1 28.09,35.77 28.09,36.87 C28.1 28.84,36.89 29.07,37.12 U10.7-8 | R19.2 57.73,44.38 TP6.1 | 19.5,45.2 13.88,50.82 Q4.C | 17.14,38.08 19.28,38.08 19.94,38.74 19.94,41.34 R2.2 19.5,41.78 19.5,45.2 | 103.7,31.2 96.3,31.2 95.5,32 95.5,32.93 C19.1 95.45,32.88 | 17.14,38.08 Q4.AN | 96.4,50.82 Q5.AN | Q5.C 106.78,38.08 103.7,35
  Top 1: 98.4,9.6 98.4,4.54 J2.3 | TP6.1 52.91,49.2 32.9,49.2 | U$4.IN 43.7,9 47.7,13 47.7,16.4 45.3,18.8 40.78,18.8 U$3.IN 40.68,21 36.48,25.2 22.1,25.2 21.9,25.4 21.9,34.1
!BEN
  Top 0.2: 66.15,38.45 C12.1
  Top 0.35: 60.03,37.03 U$5.VIN
  Top 1: 60.03,37.03 61.45,38.45 D1.2 66.15,38.45
+12V
  Top 0.2: 86.06,11.04 86.27,11.23
  Top 0.5: 36.89,29.81 C5.1 | 34.05,33.16 R1.2 33.21,35.09 32.27,36.03 U10.12-13 | C6.1 34.1,29.86 | 34.1,29.86 35.26,29.86 | C10.1 34.1,29.86 | U$8.D1 56.9,18.9 C22.1 56.8,20.7 | 78.2,11.9 77.47,11.9 76.5,12.87 76.7,13.07 C1.1 | 78.2,11.9 R34.2 | 78.2,10.1 78.2,11.9 | U2.3 86.06,11.04
  Top 0.75: Q6.4 78.2,10.1
  Top 1: 34.05,33.16 C10.1 | 35.26,29.86 C5.1 | 86.27,11.23 82.9,14.6 78.23,14.6 76.5,12.87 63.9,12.87 61.9,14.87 | 56.8,20.7 56.2,21.3 45.4,21.3 36.89,29.81
  pour Top (no thermals): 56.4,14.3 56.4,16 62.3,16 62.3,13.9 56.8,13.9
ACOK  (via drill 0.35)
  Top 0.2: R19.1 57.73,39.7 | U$5.!ACOK 57.83,39.6 57.73,39.7 | 57.73,39.7 57.13,40.3 v57.13,40.33 56.75,40.7 D3.C | v88.9,41.7 88.97,41.63 U1.30
  Bottom 0.2: v57.13,40.33 62.63,40.33 68.3,46 84.6,46 v88.9,41.7
ARM-IN  (via drill 0.35)
  Top 0.2: R23.2 40.77,30.63 41.3,30.1 v42,30.1 | v24.7,16.8 24.35,16.45 JP2.2
  Bottom 0.2: v42,30.1 28.7,16.8 v24.7,16.8
ARM-OUT  (via drill 0.35)
  Top 0.2: JP2.1 20.25,21.09 21.46,22.3 v22.3,22.3 | R25.1 44.66,32.74 v45.5,31.9
  Bottom 0.2: v22.3,22.3 31.9,31.9 v45.5,31.9
BATT_READ
  Top 0.2: R16.2 R15.1 89.49,43.81 89.8,43.5 89.8,39.96 U1.29
CAN_RX  (via drill 0.35)
  Top 0.2: TP1.1 91.7,48.1 94.5,45.3 v94.5,42.7 | v95.7,36.1 95.68,36.08 U1.21
  Bottom 0.2: v94.5,42.7 95.7,41.5 v95.7,36.1
CAN_TX  (via drill 0.35)
  Top 0.2: U1.22 96.32,36.88 v96.4,36.8 | v95.5,42.8 95.5,45.8 TP2.1
  Bottom 0.2: v96.4,36.8 96.4,41.9 v95.5,42.8
CHUTE
  Top 0.5: U$3.ANOD 28.8,18.7 25.1,15 25.1,11.5 22.43,8.83 JP2.5
DCM+
  pour Top (isolate 0.2, no thermals): 81.2,9.2 77.8,9.2 77.8,2.4 81.2,2.4
DCM_ON
  Top 0.2: U1.13 90.57,27.35 R35.1 89.3,27.3 88,26 Q3.1
DCM_PWM  (via drill 0.35)
  Top 0.2: J1.4 70.94,8.28 R11.1 v70.79,10.29 v70.8,10.3 | v89,29.3 89,31.4 U1.11
  Bottom 0.2: v70.8,10.3 71.8,11.3 79,11.3 89,21.3 v89,29.3
DCM_SPEED  (via drill 0.35)
  Top 0.2: R13.2 68.3,8.86 v68.3,10.3 | v80,32.3 80,33.55 R14.1 81.35,33.65 82.1,32.9 83.4,32.9 84.98,34.48 U1.6
  Bottom 0.2: v68.3,10.3 68.3,20.6 v80,32.3
DCMDIR  (via drill 0.35)
  Top 0.2: J1.3 73.48,8.38 R12.1 73.43,10.23 v73.5,10.3 | v89.8,29.9 89.8,31.4 U1.12
  Bottom 0.2: v89.8,29.9 89.8,20.7 79.4,10.3 v73.5,10.3
DROGUE
  Top 0.5: JP2.6 23.59,6.29 26.3,9 U$4.ANOD
GND  (via drill 0.25, 0.35)
  Top 0.2: C20.2 87.35,39.95 U1.32 | C18.2 83.33,34.77 v83.9,34.2 | U$5.GND 59.1,33.24 59.1,34.2 59.04,34.2 | U$5.!EN 57.44,35.46 57.79,35.11 U$5.EP | U10.4 30.12,38.32 30.1,38.3 30.15,38.25 30.65,38.25 30.87,38.03 U10.10
  Top 0.5: U$5.EP 59.04,34.2
  other vias: 52.4,18.3 86.8,13.5 88.4,36.5 92.1,38.1 88.7,34.3 74.9,42.6 63.8,47 46.3,44.2 100,11.4 94.3,31.3 83.4,37.7 102,33.7 96.9,32 28.1,41.2 25.9,35.3 33.9,27.2 52.4,19.5 76.2,8.4 87.5,1.9 103.6,2.1 102.3,11.4 94.5,19.2 90.5,24.4 92.3,25.9 87.4,41.1 103.2,43.2 92.9,45.1 67.7,40.3 60.6,32.9 50.4,32.4 82.7,6.8 53.5,4.4 47.1,3.9 45.1,12.7 14.5,44.3 23.1,46.8 23.8,11.5 24.4,19.3 56.2,37.1 102,34.9 98.1,11.4 55.2,37 57.5,35.8 58.8,35.8 58.8,34.4 57.5,34.4 37.3,43 37.4,39.3 44.7,37.9 14.9,47.9 37.4,33.7 39,30.3 55.6,26 63.3,31.8 68.8,38.5 61.1,45.8 59.6,42.5 51.4,42.4 50.4,35.3 78.4,37.3 81.7,42.5 77.5,33.7 80.4,34.8 95.8,29.1 105.9,41.7 103.5,7.2 104.9,11.4 27.9,11.3 35.8,21.4 36.1,15.4 36.1,11.3 42.7,40.8 39.9,35.7 39.2,46.9 69.4,43.3 61.7,25.4 79.3,30.5 109.6,27.6 109.7,15.6 118,26.5 117.7,15.2 117.9,39 118.1,50.8 103.7,53.2 90,48.9 3.2,39.8 19.1,30.4 27.8,21.9 23.6,33 22.8,37.2
  pour Top (isolate 0.2, rank 6): 0,0 0,54.61 120.9,54.61 120.9,0
  pour Bottom (isolate 0.2, rank 6): 0,0 0,54.61 121.2,54.61 121.2,0
GND1  (via drill 0.35)
  other vias: 84.4,11.2
GND2  (via drill 0.35)
  other vias: 90.6,9.9
GND3  (via drill 0.35)
  other vias: 90.5,22
GND4  (via drill 0.35)
  other vias: 82.1,16.1
GND5  (via drill 0.35)
  other vias: 82.4,20.9
GND6  (via drill 0.35)
  other vias: 75.5,25.3
GND7  (via drill 0.35)
  other vias: 73.2,29.6
GND8  (via drill 0.35)
  other vias: 73.3,37.2
GND9  (via drill 0.35)
  other vias: 63.5,22.1
GND10  (via drill 0.35)
  other vias: 70.9,20.6
GND11  (via drill 0.35)
  other vias: 66.5,16.2
GND12  (via drill 0.35)
  other vias: 55,1.8
GND13  (via drill 0.35)
  other vias: 58.8,1.7
GND14  (via drill 0.35)
  other vias: 69.8,29.6
IN1  (via drill 0.35)
  Top 0.2: U1.18 99.06,33.68 R32.1 99.11,32.71 v99,32.6 | U2.5 84.7,3.89 v84.7,1.9
  Bottom 0.2: v84.7,1.9 99,16.2 v99,32.6
IN2  (via drill 0.35)
  Top 0.2: U1.19 96.26,34.48 96.61,34.83 R33.1 v99.11,36.19 v99.1,36.2 | U2.6 86,3.92 v86,1.9
  Bottom 0.2: v86,1.9 99.7,15.6 99.7,35.9 99.4,36.2 v99.1,36.2
ISO-CHUTE  (via drill 0.35)
  Top 0.2: U$3.OUT 42.26,13.62 42.97,14.33 R28.1 44.07,15.53 v44,15.6 | v78.1,31.4 87.34,31.4 U1.9
  Bottom 0.2: v44,15.6 62.3,15.6 v78.1,31.4
ISO-DROGUE  (via drill 0.35)
  Top 0.2: U$4.OUT R29.1 44.2,4.06 v44.2,5.3 | U1.10 88.17,29.93 86.95,28.7 v85.2,28.7
  Bottom 0.2: v44.2,5.3 46.7,7.8 68.4,7.8 70.2,9.6 70.2,10.01 70.17,10.04 70.17,10.56 70.2,10.59 70.2,18.5 80.4,28.7 v85.2,28.7
LAMOTOR+
  Top 0.2: 93.4,4.62 J2.1
  Top 0.5: U2.2 87.33,10.44 88.3,11.4
  Top 1: 88.3,11.4 91.9,11.4 93.4,9.9 93.4,4.62
LAMOTOR-
  Top 0.5: 88.61,2.29 U2.8
  Top 1: J2.2 95.84,2.34 94.9,1.4 89.5,1.4 88.61,2.29
LED
  Top 0.2: U1.14 91.37,20.27 90.35,19.25 D5.A
N$1
  Top 0.2: Q1.3 95.7,25.3 95.3,24.9 92.4,24.9 91.72,24.22 91.72,22.5 U$7.NEG
N$2
  Top 0.2: R8.1 Q4.CAT
N$4
  Top 0.2: R31.1 D5.C
N$5
  Top 0.2: R9.1 111.04,48.39 Q5.CAT
N$6  (via drill 0.25, 0.35)
  Top 0.2: R34.1 80.3,11.8 80.8,11.8 | Q6.3 80.8,11.8 | v83,11.7 82.9,11.8 80.8,11.8 | v86.8,12.4 89.6,12.4 90.2,13 Q3.3
  Bottom 0.2: v86.8,12.4 83.7,12.4 v83,11.7
N$7
  Top 0.5: R26.1 24.89,6.67 23.35,5.13 19.01,5.13 18.32,5.81 18.32,6.77 19.01,7.45 22.19,7.45 26.3,11.56 26.3,14.9 27.56,16.16 U$3.CATH
N$10
  Top 0.2: C13.1
  Top 0.35: C13.1 U$5.SW
  Top 0.5: L2.P$1 67.43,35.45 C13.1
  Top 1: D2.2 73.07,35.38 67.64,35.38 L2.P$1
N$11
  Top 0.2: C13.2 61.47,34.05 60.71,34.81 U$5.BST
N$12
  Top 0.2: 54.08,35.98 55.23,34.83 56.21,34.83 U$5.CELLS | 54.08,35.98 52.67,37.39 R18.2 R30.2 52.8,41.43 C21.1 52.8,43.76 R17.2 | 54.08,35.98 54.21,36.11 U$5.VREF33
N$13
  Top 0.2: D6.C 56.75,38.1 57.18,37.67 U$5.!CHGOK
N$14
  Top 0.2: D3.A R30.1
N$16  (via drill 0.35)
  Top 0.2: R24.2 R23.1 41.46,32.54 50,24 v50,22.5 | v51.7,16.2 54.3,13.6 54.3,10.2 55.1,9.4 U$8.G
  Bottom 0.2: v50,22.5 51.7,20.8 v51.7,16.2
N$17
  Top 0.2: R18.1 D6.A
N$18
  Top 0.2: U$5.COMPV 55.36,34.16 55,33.8 R20.2
N$19
  Top 0.2: U$5.TMR 60.03,32.37 C15.1
N$20
  Top 0.2: R17.1 54.09,43.65 56.19,43.65 57.22,42.62 58.2,42.62 | 58.2,42.62 58.48,42.34 U$5.NTC | 58.2,42.62 59.61,44.04 U$6.P2
N$21
  Top 0.2: U$5.COMPI 56.56,33.21 55.73,32.38 R21.2
N$22
  Top 0.2: R21.1 C16.1
N$26
  Top 0.2: R27.1
  Top 0.5: U$4.CATH 30.7,6.66 R27.1
N$27  (via drill 0.35)
  Top 0.2: 100.9,48.39 99.41,48.39 v98.1,49.7 | 100.9,48.39 R9.2 | v2.8,53.17 2.8,48.2 3.9,47.1 3.9,47.07 8.6,47.07 13.97,41.7 R8.2 | Q2.3 100.9,48.39
  Bottom 0.2: v98.1,49.7 97.13,50.67 97.13,52.06 95.99,53.2 2.8,53.2 v2.8,53.17
N$28
  Top 0.152: U$5.CSP 58.48,30.32 59.2,29.6 59.2,28.7 59.63,28.27 R22.2
  Top 1: R22.2 66.99,28.27 67.5,28.78 L2.P$2
N$30
  Top 0.2: R20.1 C14.1
NRST  (via drill 0.35)
  Top 0.2: CM1.10 101.88,25.82 v97.3,30.4 | v82.4,33.5 82.4,35.34 83.11,36.05 85.89,36.05 U1.4
  Bottom 0.2: v97.3,30.4 94.1,30.4 91,33.5 v82.4,33.5
OSC_IN
  Top 0.2: C3.1 80.35,40.1 | 80.35,40.1 80.35,39.34 Y1.IN/OUT | U1.2 85.12,37.68 82.5,40.3 80.55,40.3 80.35,40.1
OSC_OUT
  Top 0.2: Y1.OUT/IN 81.65,37.6 C4.1 81.72,36.4 84.6,36.4 85.08,36.88 U1.3
POT_OUT_AN  (via drill 0.35)
  Top 0.2: J2.4 100.92,7.22 101.81,8.12 109.1,8.12 113.51,12.53 113.51,32.9 113.5,32.91 113.5,33.3 v109.97,36.83 | U1.20 97.39,35.28 98.91,36.8 v100.4,36.8
  Bottom 0.2: v109.97,36.83 100.43,36.83 v100.4,36.8
PULSEOUT
  Top 0.2: R13.1 68.35,4.58 J1.5
SENSOR1  (via drill 0.35)
  Top 0.2: U1.28 90.49,40.01 v90.49,43.9 | R7.2 12,47.97 | 12,47.97 10.17,47.97 9.86,48.28 Q4.E | v11.9,49.2 11.9,48.07 12,47.97
  Bottom 0.2: v90.49,43.9 87.6,43.9 82.3,49.2 v11.9,49.2
SENSOR2  (via drill 0.35)
  Top 0.2: v91.3,41.2 91.37,41.13 U1.27 | v97.1,40 94.9,40 v93.5,41.4 | v105,39.9 105.9,39 106.9,39 107.46,39.56 107.46,40.62 R10.2 111.06,40.53 Q5.E
  Bottom 0.2: v93.5,41.4 93.3,41.2 v91.3,41.2 | v97.1,40 104.9,40 v105,39.9
SENSOR_ON  (via drill 0.35)
  Top 0.2: U1.26 92.17,41.17 | 92.17,41.17 91.47,41.87 R36.1 | v92.61,42.21 92.61,41.61 92.17,41.17 | Q2.1 v97.9,43.6
  Bottom 0.2: v97.9,43.6 94,43.6 v92.61,42.21
SPKR
  Top 0.2: 92.17,29.3 U1.15 | 92.17,29.3 93.3,29.3 R37.1 | Q1.1 92.55,27.75 92.17,28.13 92.17,29.3
SWCLK  (via drill 0.35)
  Top 0.2: CM1.4 98.07,23.67 v100.4,26 | U1.24 97.58,38.48 v97.7,38.6
  Bottom 0.2: v100.4,26 100.4,35.9 v97.7,38.6
SWDIO  (via drill 0.35)
  Top 0.2: CM1.2 96.8,24.7 v98,25.9 | v97.6,37.6 94.5,37.6 U1.23
  Bottom 0.2: v98,25.9 98,37.2 v97.6,37.6
T_GND
  Top 0.5: R27.2 R26.2 26.25,4.37 25.63,3.75 JP2.7
TPS-EN
  Top 0.2: R1.1 34.05,36.89 33.06,37.88 U10.14 31.82,37.88 31.62,38.08 U10.1 31.62,39.32 33.7,41.4 34.2,41.4 34.21,41.39 TP29.1
TPS-FB
  Top 0.2: U10.5 28.93,38.38 25.24,42.06 R3.2
  Top 0.3: R2.1 22.71,41.41 23.36,42.06 R3.2
TPS-FB2
  Top 0.2: TP27.1 27.21,38.69 28.05,37.85 29.45,37.85 U10.6
TPS-L1
  Top 0.2: U10.11 31.36,36.87 31.4,36.83 31.4,34.3 29.82,32.72 L1.P$1
TPS-L2
  Top 0.2: L1.P$2 25.12,30.3 25.27,30.15 26.85,30.15 27.9,31.2 27.9,33.2 30.37,35.67 U10.9
TPS-PG
  Top 0.2: TP26.1 33.82,44.29 31.94,42.41 R5.1 31.24,39.64 31.12,39.52 U10.2
TPS-VAUX
  Top 0.2: U10.3 30.62,39.28 30.5,39.4 C7.1
TPS-VSEL
  Top 0.2: U10.15 34.62,38.38 TP28.1 R4.2
USART2_RX  (via drill 0.35)
  Top 0.2: JP3.1 76.86,21.66 TP3.1 77,24.7 81.4,29.1 v81.4,29.25 | U1.25 94.07,39.93 94.7,39.3 v94.7,39.2
  Bottom 0.2: v94.7,39.2 86.7,39.2 81.4,33.9 v81.4,29.25
USART2_TX  (via drill 0.35)
  Top 0.2: JP3.2 79.4,21.7 TP4.1 79.5,26.3 v83.7,30.5 | v85.8,32 85.8,32.76 U1.8
  Bottom 0.2: v83.7,30.5 85.2,32 v85.8,32
VBAT  (via drill 0.35)
  Top 0.152: U$5.BATT 57.83,30.37 58.7,29.5 58.7,28.6 58.4,28.3 57.74,28.3 57.63,28.41
  Top 0.5: 57.63,28.41 R22.1 57.49,22.71 | C17.1 43.26,36.17 R25.2 43.26,32.34 | R15.2 80.03,45.13
  Top 1: 63.8,17 v65.7,15.1 v65.7,14.3 | 43.26,32.34 52.89,22.71 57.49,22.71 58.09,22.71 63.8,17 | 80.03,45.13 76.3,41.4 76.3,29.5 63.8,17
  Bottom 1: v65.7,15.1 v65.7,14.3 v65.7,11 v64.7,11
  pour Top: 60,2.8 64.6,2.8 64.6,10.5 66.4,10.5 66.4,11.6 61.4,11.6 61.4,10.3 57.7,10.3 57.7,8.5 61.2,8.5 61.2,6.2 59.9,6.2 59.9,2.8
VUMB  (via drill 0.35)
  Top 0.2: 59.2,38.7 59.13,38.63 U$5.VCC
  Top 0.5: 63.56,42.48 C11.1 61.19,40.69 59.2,38.7
  Top 1: 63.56,42.48 D1.1 63.9,42.82 v63.9,44.7 | v64.9,44.7 v62.9,44.7
  Bottom 1: JP2.3 37.71,13.91 48.4,24.6 48.4,41.6 51.5,44.7 v62.9,44.7 v63.9,44.7 v64.9,44.7

### Text on the board
tPlace: Recovery Board Rev1.0 | USART2 | STATUS | LIN-ACT | BATT | DCMOTOR | POT- | POT | POT+ | M- | M+ | LAMOTOR+ | GND | VBAT
Document: 3.3 SPS | LiPo | TODO / 1. I have CAN and USART Pins currenlty doing nothing / 2. Need to add locking button